# EasyEDA schematic SCH_lab05_2021-12-17(1).json

## Sheets
1 Sheet_1: TITLE: Sheet_1; REV: 1.0; Date: 2021-12-17; Sheet: 1/1; Drawn By: huseyin34; Company: Your Company
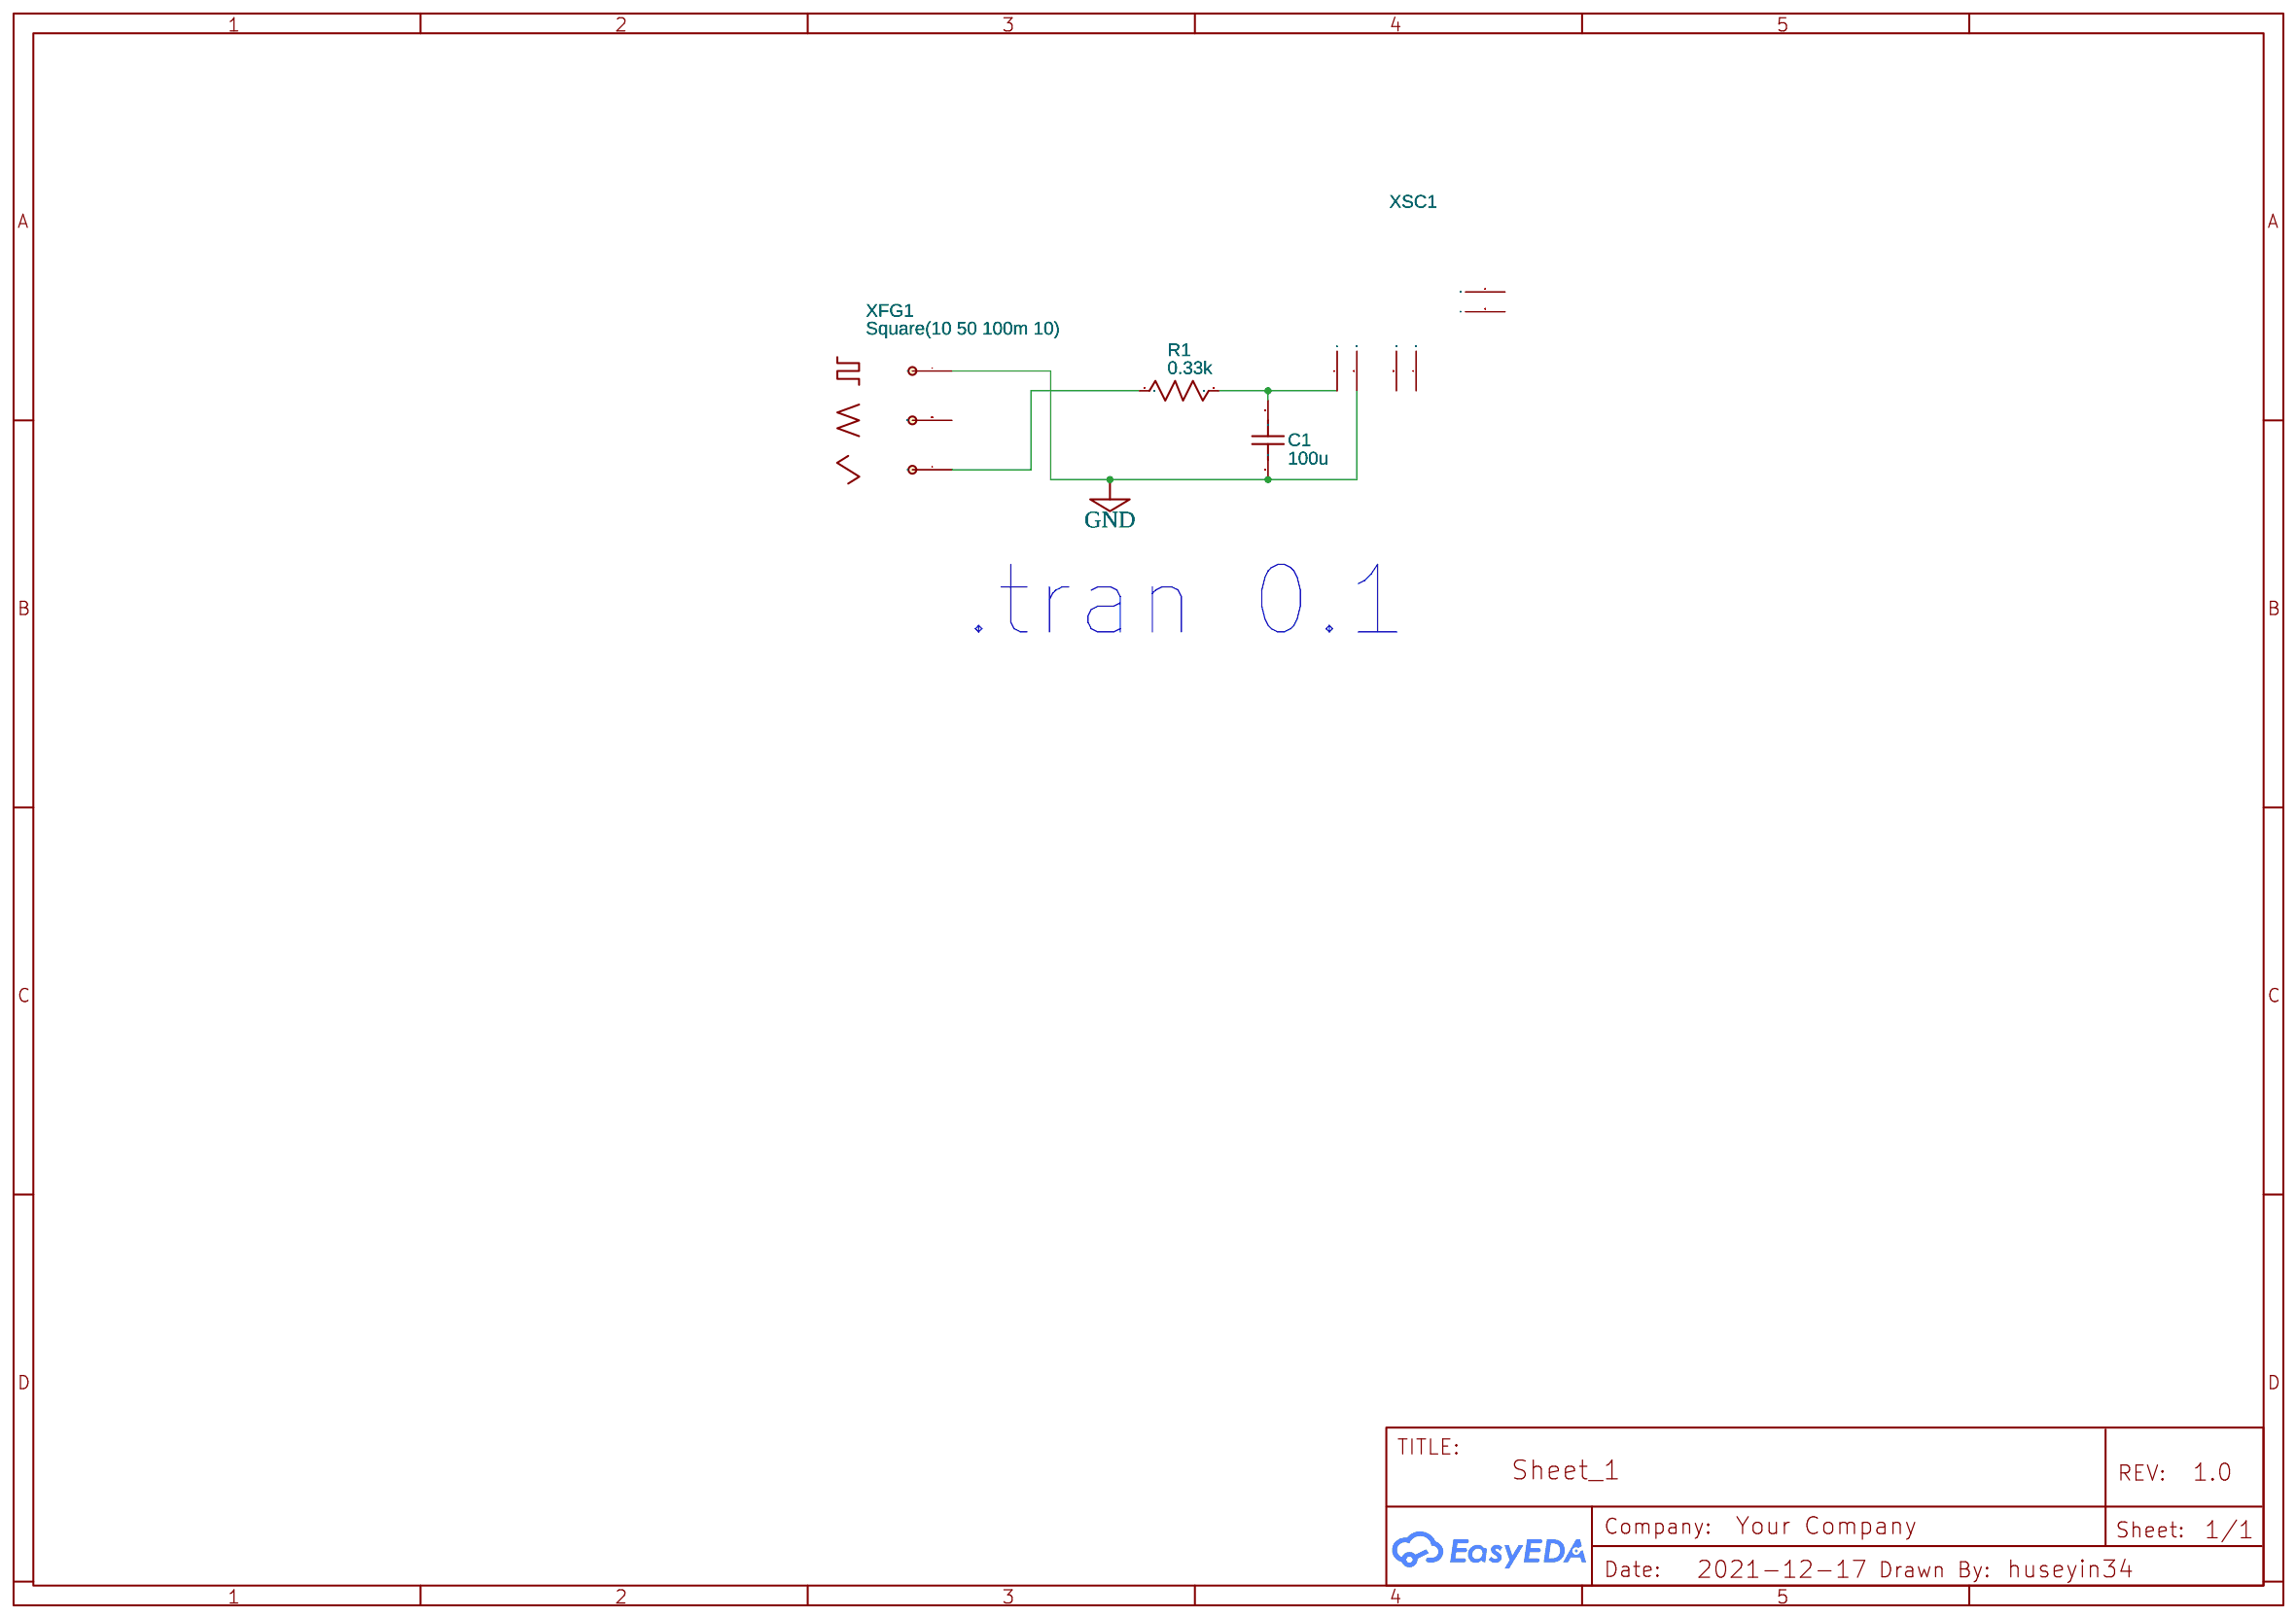
[diagram p0: Sheet_1]
2 Sheet_2: TITLE: Sheet_2
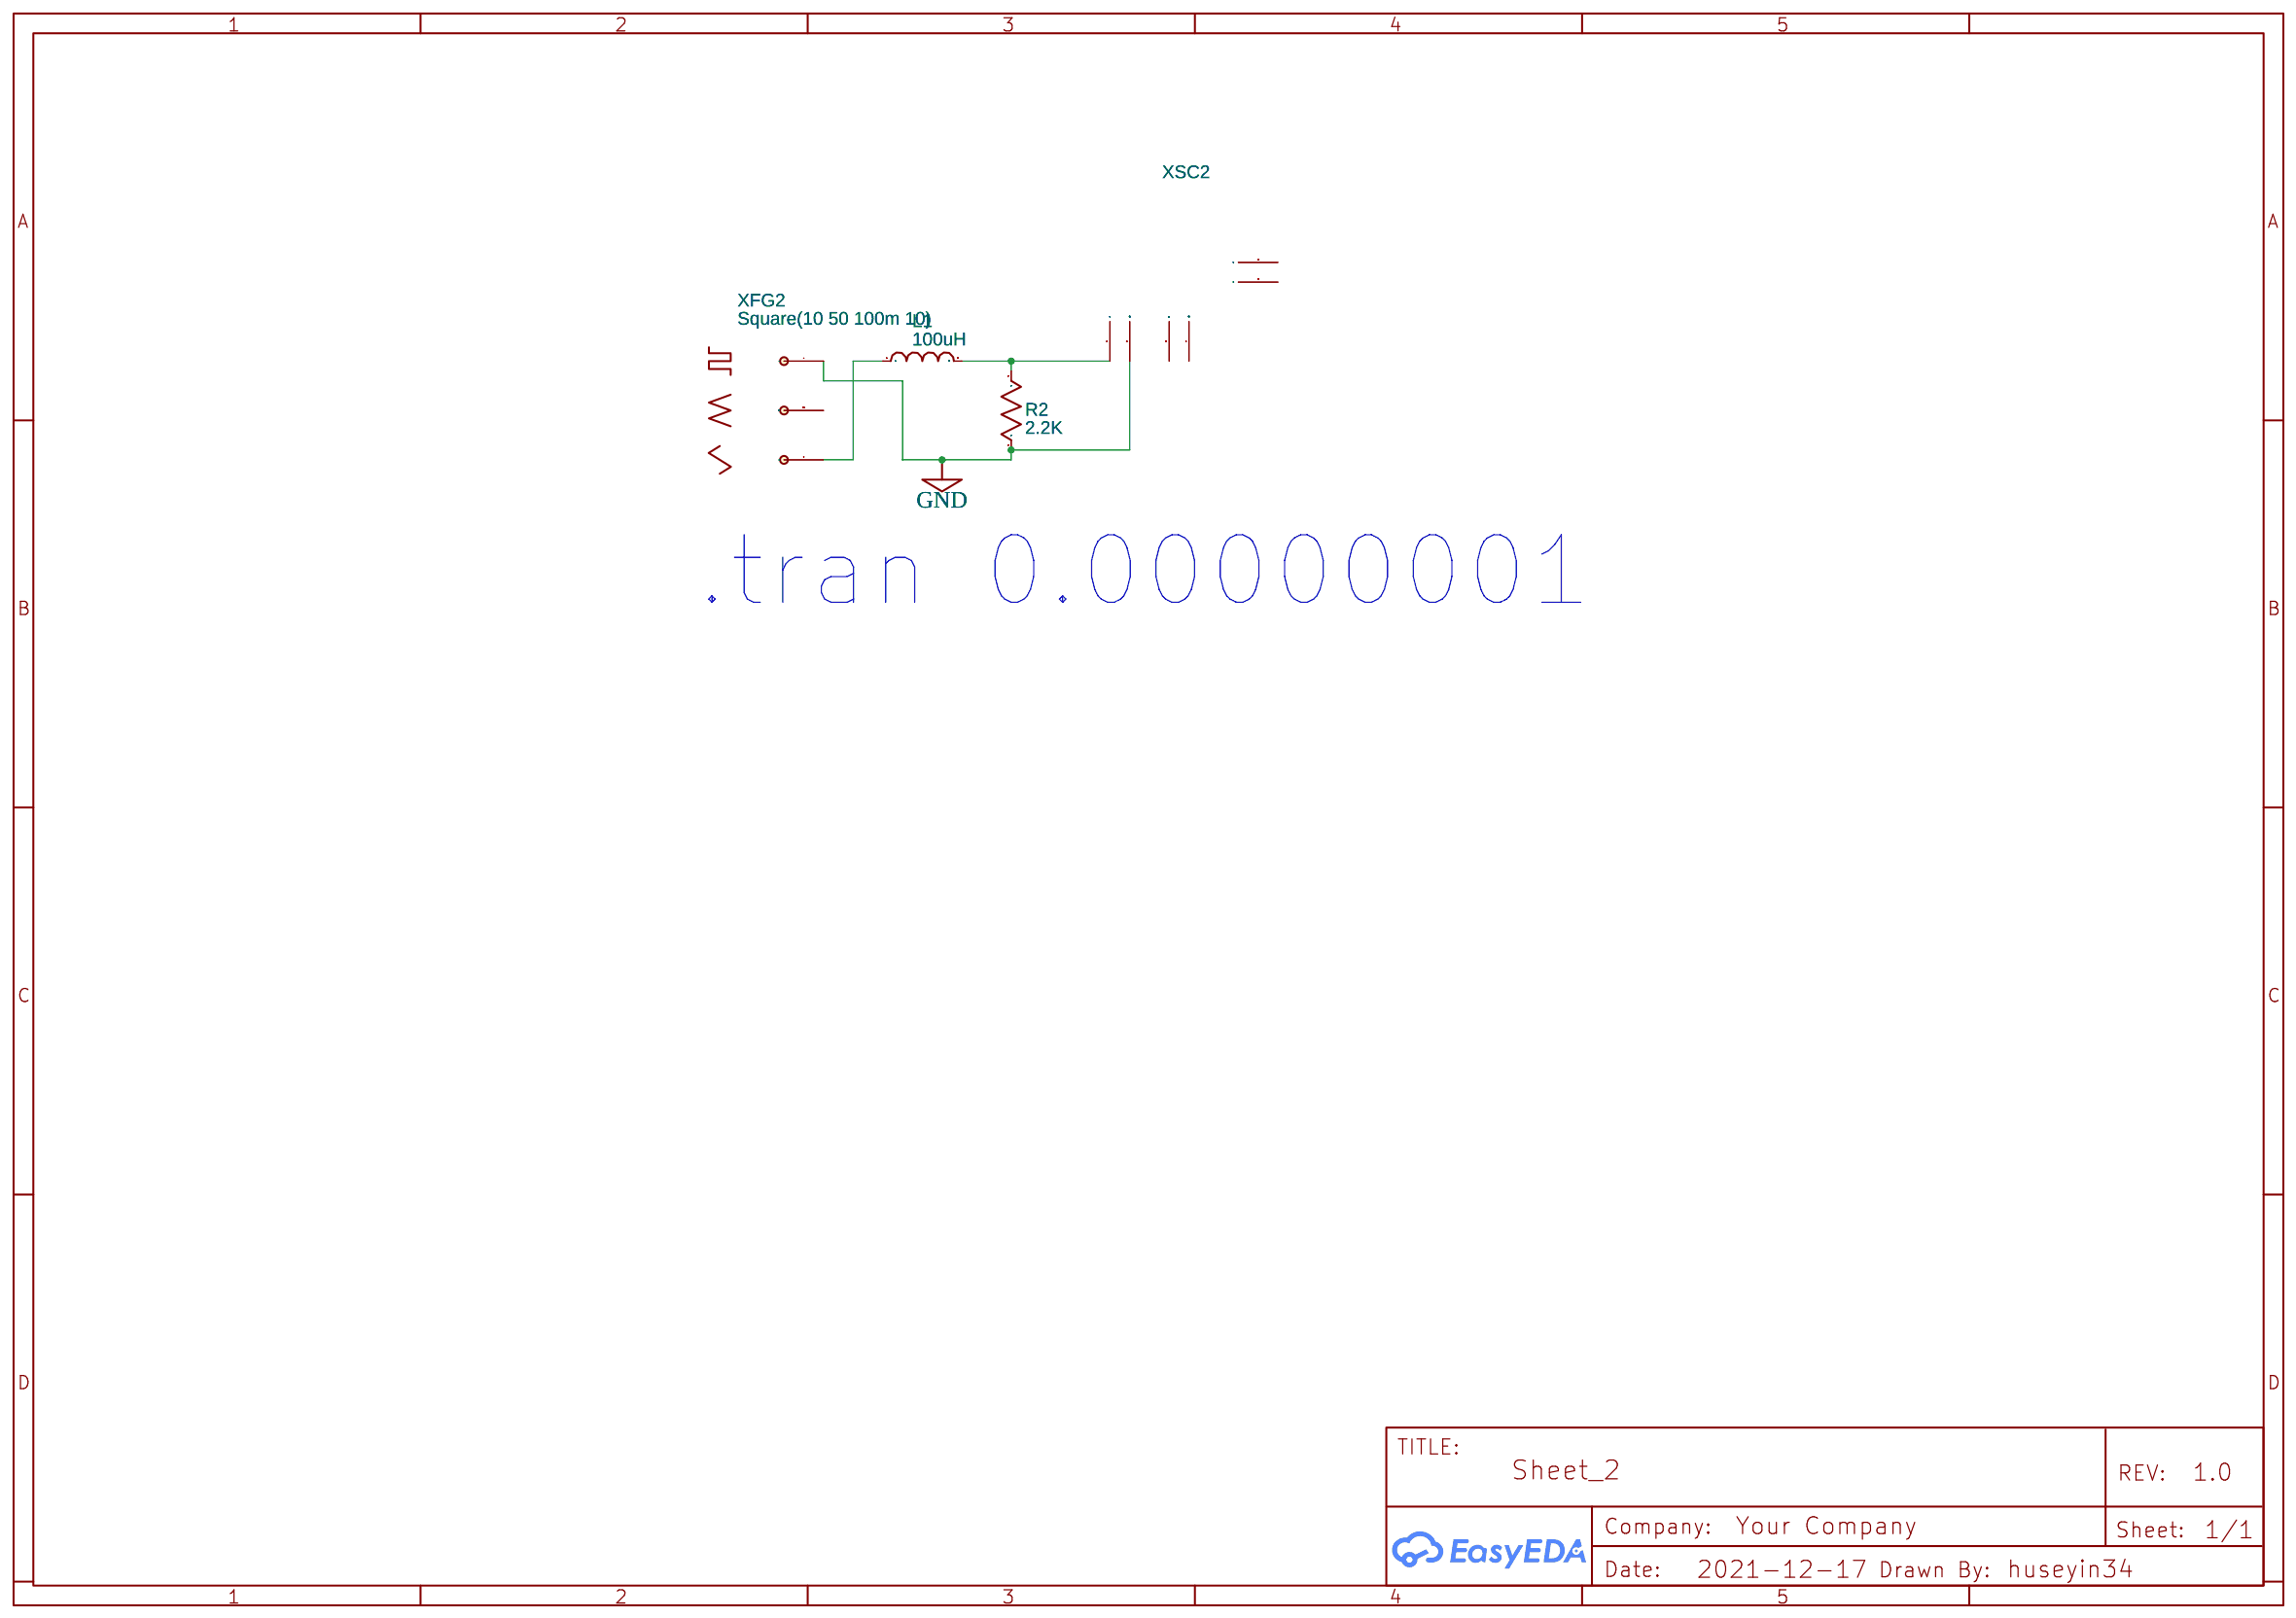
[diagram p1: Sheet_2]
3 Sheet_3: TITLE: Sheet_3
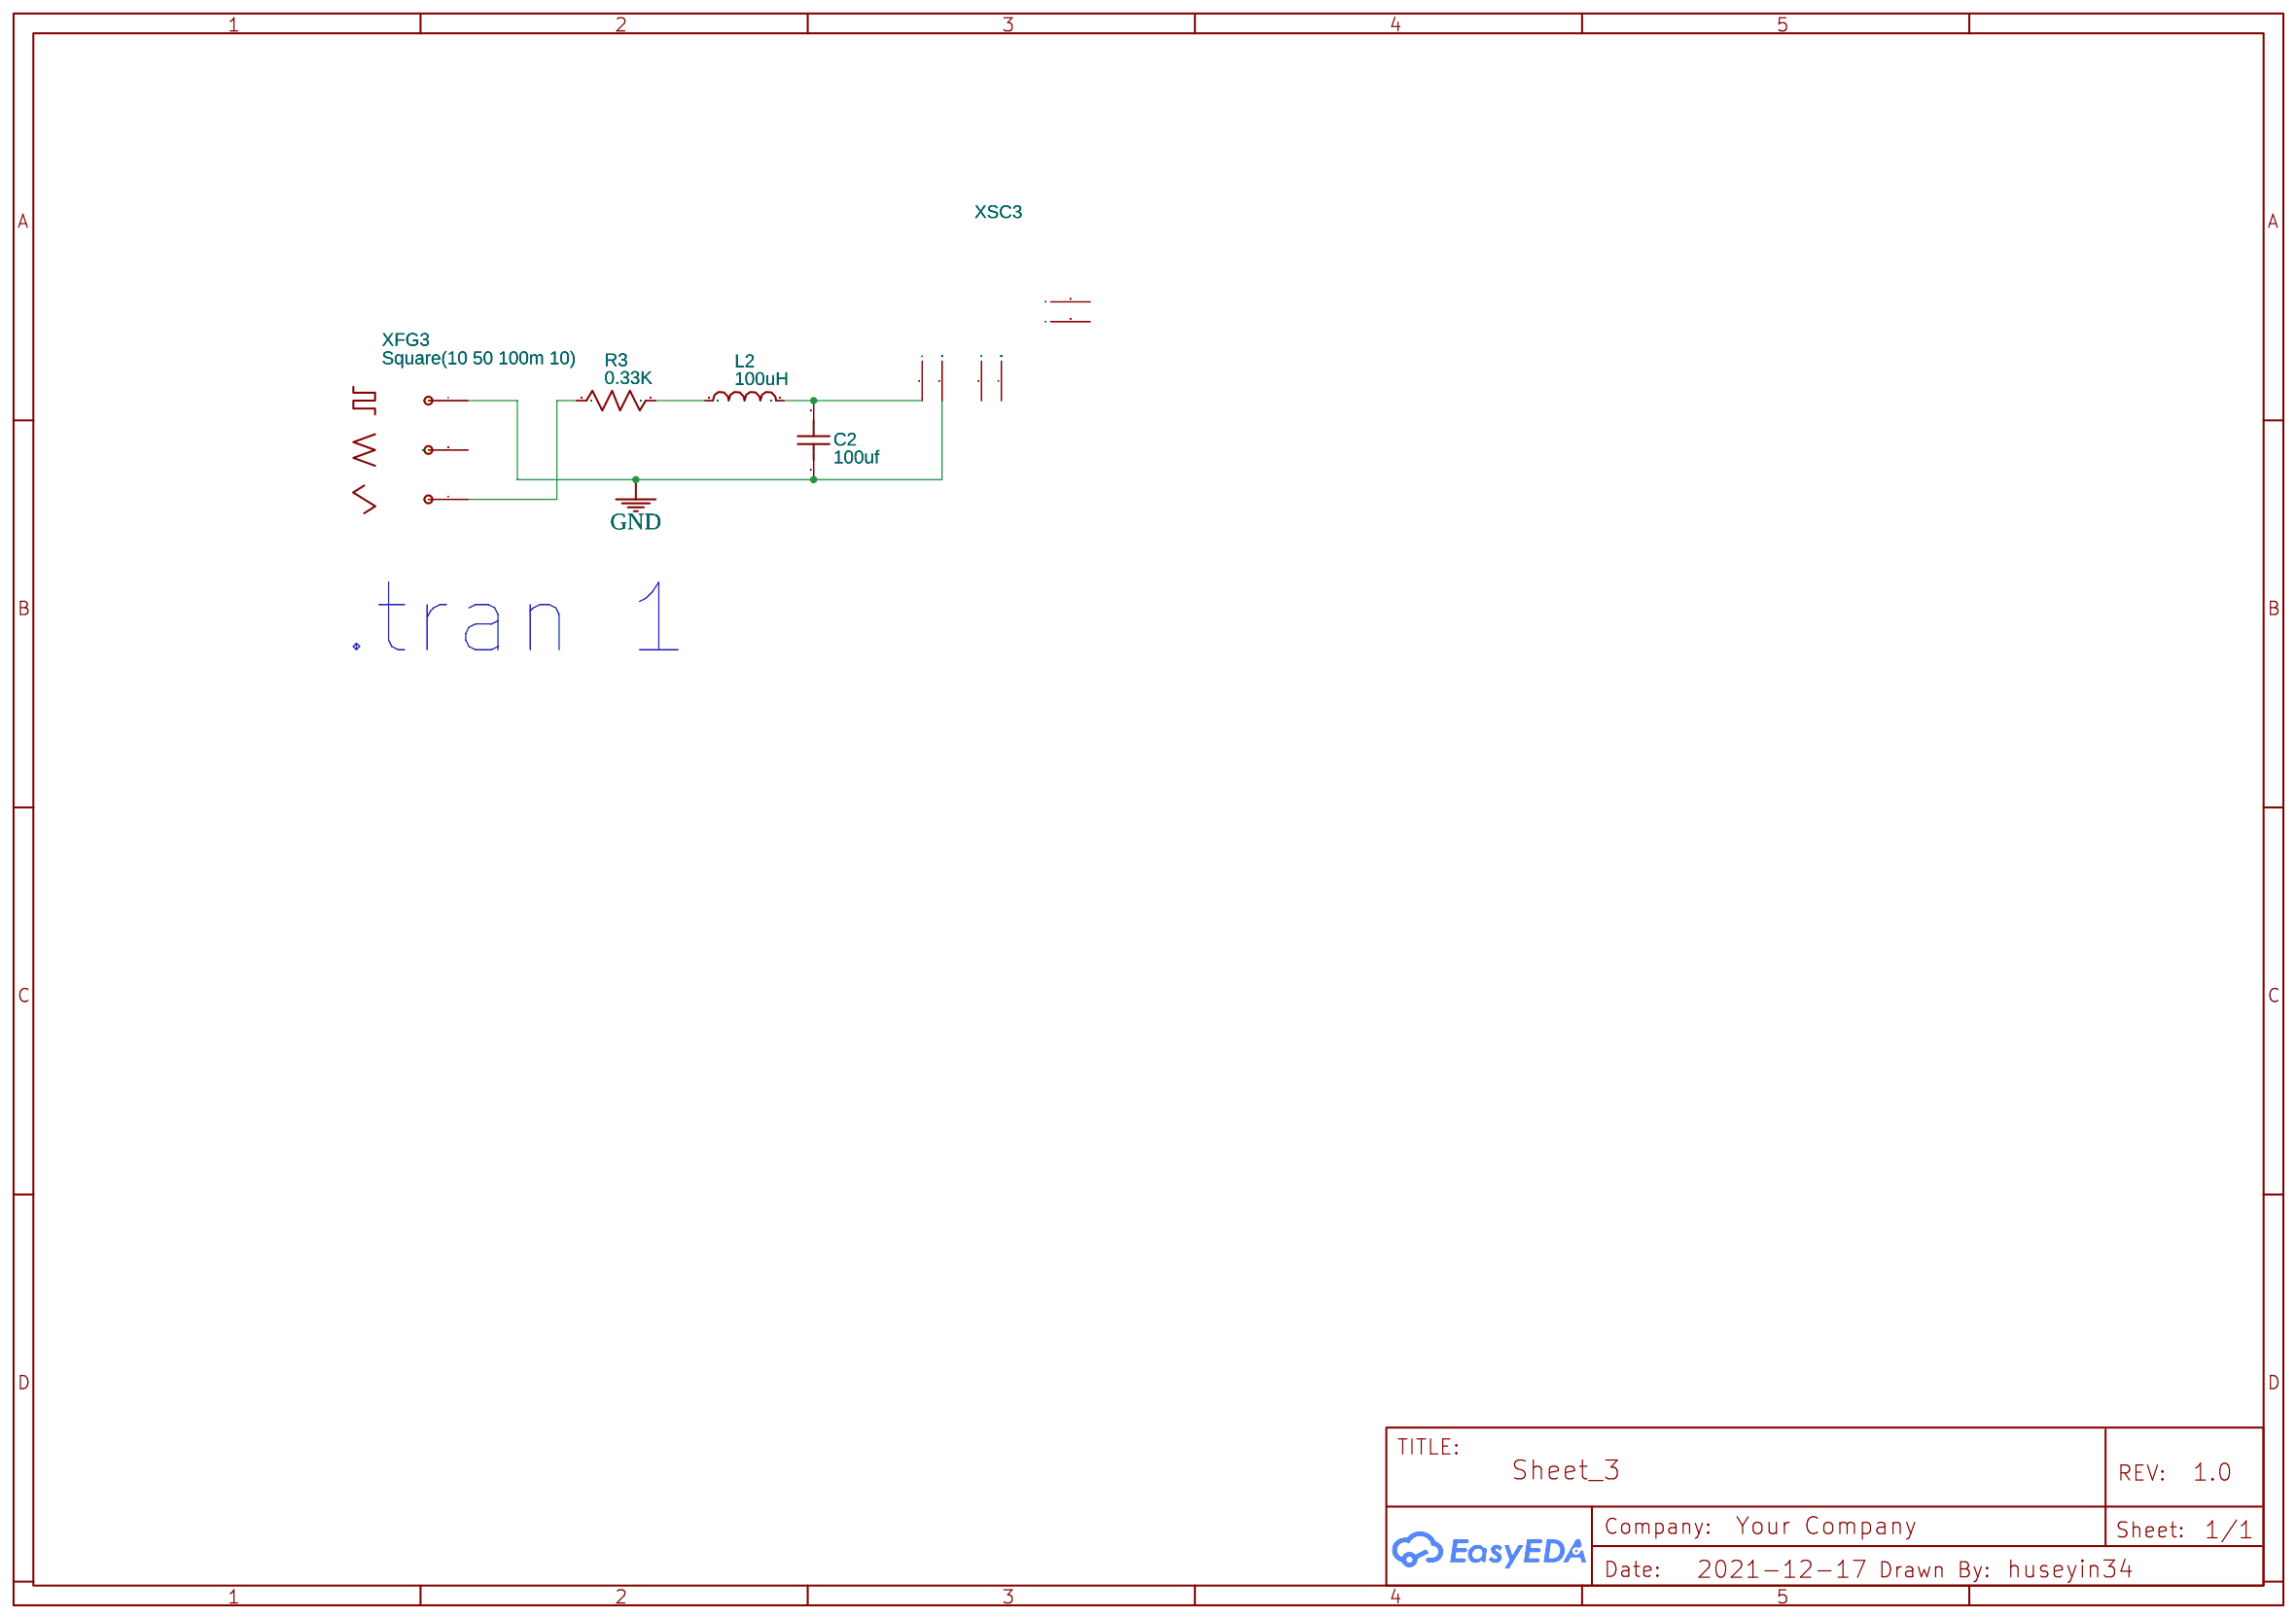
[diagram p2: Sheet_3]

## Parts
sheet Sheet_1
C1  100u  [RAD-0.1]
R1  0.33k  [AXIAL-0.3]
XFG1  Square(10 50 100m 10)
XSC1  Oscilloscope
sheet Sheet_2
L1  100uH  [AXIAL-0.4]
R2  2.2K  [AXIAL-0.3]
XFG2  Square(10 50 100m 10)
XSC2  Oscilloscope
sheet Sheet_3
C2  100uf  [RAD-0.1]
L2  100uH  [AXIAL-0.4]
R3  0.33K  [AXIAL-0.3]
XFG3  Square(10 50 100m 10)
XSC3  Oscilloscope

## Library data of the parts
C1 C2 = Capacitor_US: Contributor: EasyEDA; Supplier: YUJING; Capacitance: 1u
R1-R3 = Resistor_US: Resistance: 1k; Contributor: EasyEDA; Supplier: YUJING
XFG1-XFG3 = FUNCTIONGENERATOR: Supplier: LCSC; Waveforms: Rectangular Wave; Frequency: 10; Duty cycle: 50; Amplitude: 100m; Offset: 0; Rise/Fall Time: 10; NameDisplay: 1; Contributor: EasyEDA; sim: true
XSC1-XSC3 = OSCILLOSCOPE: Contributor: EasyEDA; NameDisplay: 0; sim: true
L1 L2 = Inductor: Supplier: YUJING; Contributor: EasyEDA; Inductance: 1m

## Nets
GND: C1.1 C2.1 R2.1 XFG1.- XFG2.- XFG3.- XSC1.2(GND1) XSC2.2(GND1) XSC3.2(GND1)
Net-(C1-2): C1.2 R1.2 XSC1.1(A)
Net-(C2-2): C2.2 L2.2 XSC3.1(A)
Net-(L1-1): L1.1 XFG2.+
Net-(L1-2): L1.2 R2.2 XSC2.1(A)
Net-(L2-1): L2.1 R3.2
Net-(R1-1): R1.1 XFG1.+
Net-(R3-1): R3.1 XFG3.+

Not connected (* = marked no-connect by the designer): XFG1 COM; XFG2 COM; XFG3 COM; XSC1 3(B) 4(GND2) 5(T+) 6(T-); XSC2 3(B) 4(GND2) 5(T+) 6(T-); XSC3 3(B) 4(GND2) 5(T+) 6(T-)

## Notes on the sheets
sheet 1
- .tran 0.1
sheet 2
- .tran 0.00000001
sheet 3
- .tran 1
